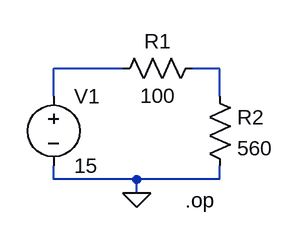
[diagram p0: schematic Thevenin_1_3.asc]
Thevenin_1_3.asc, the LTspice schematic file:
Version 4
SHEET 1 880 680
WIRE 80 48 0 48
WIRE 192 48 160 48
WIRE 0 80 0 48
WIRE 192 80 192 48
WIRE 0 176 0 160
WIRE 96 176 0 176
WIRE 192 176 192 160
WIRE 192 176 96 176
WIRE 96 192 96 176
FLAG 96 192 0
SYMBOL voltage 0 64 R0
WINDOW 123 0 0 Left 0
WINDOW 39 0 0 Left 0
SYMATTR InstName V1
SYMATTR Value 15
SYMBOL res 176 32 R90
WINDOW 0 0 56 VBottom 2
WINDOW 3 32 56 VTop 2
SYMATTR InstName R1
SYMATTR Value 100
SYMBOL res 176 64 R0
SYMATTR InstName R2
SYMATTR Value 560
TEXT 152 200 Left 2 !.op

The netlist it stands for:
* Thevenin_1_3.asc
V1 N001 0 15
R1 N002 N001 100
R2 N002 0 560
.op
.backanno
.end